# EAGLE design body-middle (EAGLE 9.6.2)
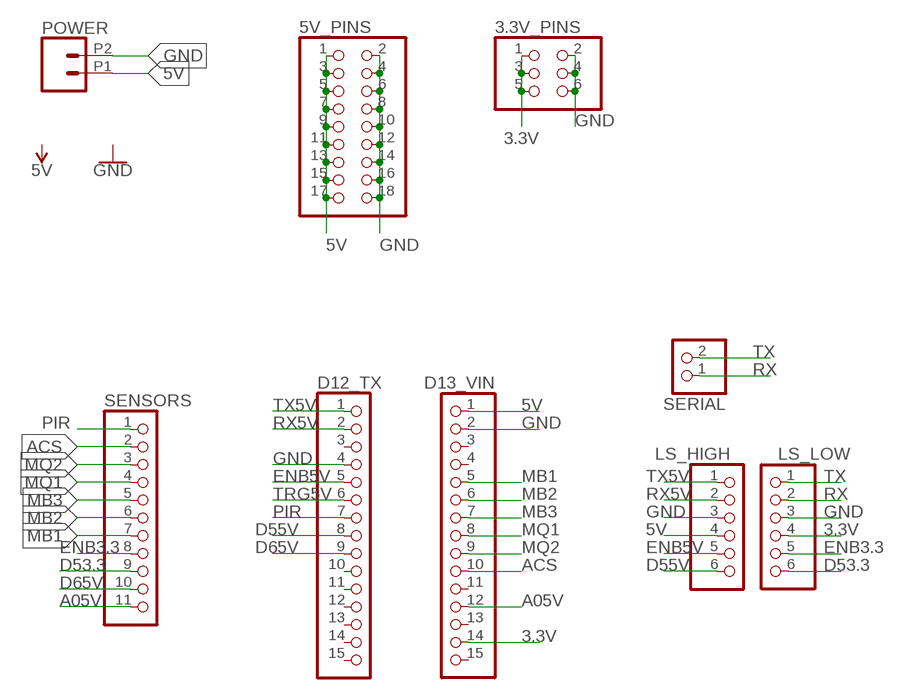
[diagram p0: schematic, sheet 1]

## Parts
3.3V_PINS  PINHD-2X3  [2X03]
5V_PINS  PINHD-2X9  [2X09]
D12_TX  PINHD-1X15  [1X15]
D13_VIN  PINHD-1X15  [1X15]
LS_HIGH  PINHD-1X6  [1X06]
LS_LOW  PINHD-1X6  [1X06]
POWER  CONN_022.54MM_SCREWTERM  [1X02_2.54_SCREWTERM]
SENSORS  PINHD-1X11  [1X11]
SERIAL  PINHD-1X2  [1X02]

## Nets
3.3V: 3.3V_PINS.1 3.3V_PINS.3 3.3V_PINS.5 D13_VIN.14 LS_LOW.4
5V: 5V_PINS.1 5V_PINS.3 5V_PINS.5 5V_PINS.7 5V_PINS.9 5V_PINS.11 5V_PINS.13 5V_PINS.15 5V_PINS.17 D13_VIN.1 LS_HIGH.4 POWER.P1
A05V: D13_VIN.12 SENSORS.11
ACS: D13_VIN.10 SENSORS.2
D53.3: LS_LOW.6 SENSORS.9
D55V: D12_TX.8 LS_HIGH.6
D65V: D12_TX.9 SENSORS.10
ENB3.3: LS_LOW.5 SENSORS.8
ENB5V: D12_TX.5 LS_HIGH.5
GND: 3.3V_PINS.2 3.3V_PINS.4 3.3V_PINS.6 5V_PINS.2 5V_PINS.4 5V_PINS.6 5V_PINS.8 5V_PINS.10 5V_PINS.12 5V_PINS.14 5V_PINS.16 5V_PINS.18 D12_TX.4 D13_VIN.2 LS_HIGH.3 LS_LOW.3 POWER.P2
MB1: D13_VIN.5 SENSORS.7
MB2: D13_VIN.6 SENSORS.6
MB3: D13_VIN.7 SENSORS.5
MQ1: D13_VIN.8 SENSORS.4
MQ2: D13_VIN.9 SENSORS.3
PIR: D12_TX.7 SENSORS.1
RX: LS_LOW.2 SERIAL.1
RX5V: D12_TX.2 LS_HIGH.2
TRG5V: D12_TX.6
TX: LS_LOW.1 SERIAL.2
TX5V: D12_TX.1 LS_HIGH.1
Unconnected: D12_TX.3 D12_TX.10 D12_TX.11 D12_TX.12 D12_TX.13 D12_TX.14 D12_TX.15 D13_VIN.3 D13_VIN.4 D13_VIN.11 D13_VIN.13 D13_VIN.15

## Library data of the parts
3.3V_PINS = pinhead:PINHD-2X3: PIN HEADER
5V_PINS = pinhead:PINHD-2X9: PIN HEADER
D12_TX D13_VIN = pinhead:PINHD-1X15: PIN HEADER
LS_HIGH LS_LOW = pinhead:PINHD-1X6: PIN HEADER
POWER = SparkFun-Connectors:CONN_02: Multi connection point. Often used as Generic Header-pin footprint for 0.1 inch spaced/style header connections On any of the 0.1 inch spaced packages, you can populate with these: Break Away Headers - Straight <https://www.sparkfun.com/products/116> (PRT-00116) Break Away Male Headers - Right Angle <https://www.sparkfun.com/products/553> (PRT-00553) Female Headers <https://www.sparkfun.com/products/115> (PRT-00115) Break Away Headers - Machine Pin <https://www.sparkfun.com/products/117> (PRT-00117) Break Away Female Headers - Swiss Machine Pin <https://www.sparkfun.com/products/743> (PRT-00743) For SCREWTERMINALS and SPRING TERMINALS visit here: Screw Terimnals on SparkFun.com <https://www.sparkfun.com/search/results?term=Screw+Terminals> (5mm/3.5mm/2.54mm spacing) This device is also useful as a general connection point to wire up your design to another part of your project. Our various solder wires solder well into these plated through hole pads. Hook-Up Wire - Assortment (Stranded, 22 AWG) <https://www.sparkfun.com/products/11375> (PRT-11375) Hook-Up Wire - Assortment (Solid Core, 22 AWG) <https://www.sparkfun.com/products/11367> (PRT-11367) View the entire wire category on our website here <https://www.sparkfun.com/categories/141> Special notes: Molex polarized connector foot print use with: PRT-08233 with associated crimp pins and housings. 2.54_SCREWTERM for use with PRT-10571. 3.5mm Screw Terminal footprints for PRT-08084 5mm Screw Terminal footprints for use with PRT-08432
SENSORS = pinhead:PINHD-1X11: PIN HEADER
SERIAL = pinhead:PINHD-1X2: PIN HEADER

## Board
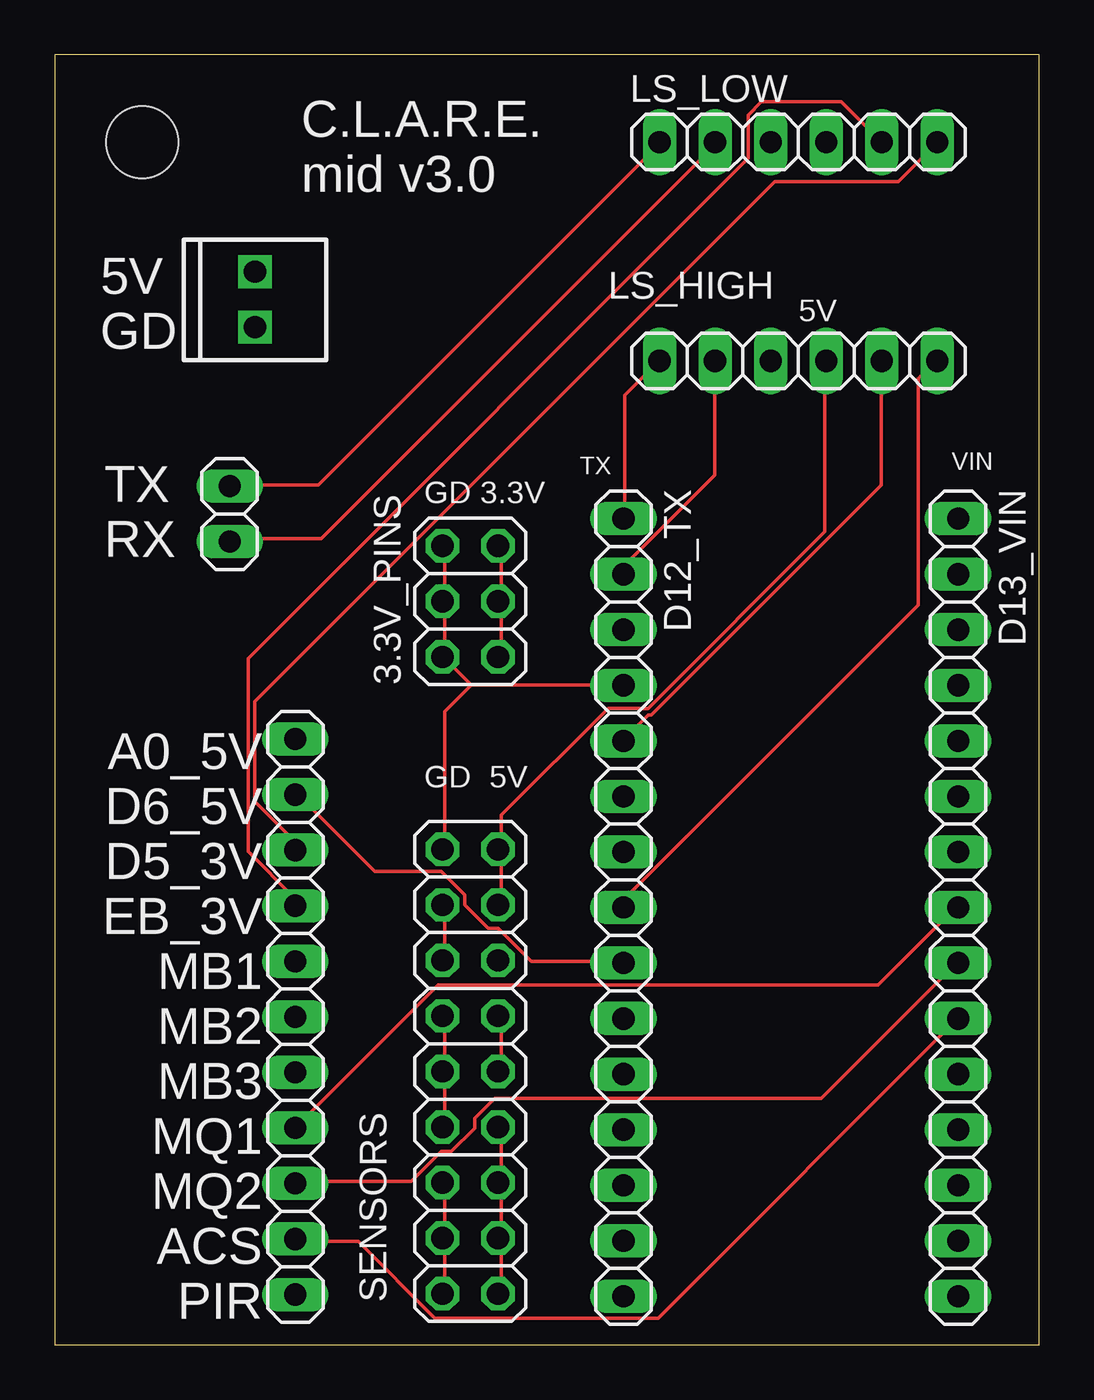
[diagram p1: board, top side]
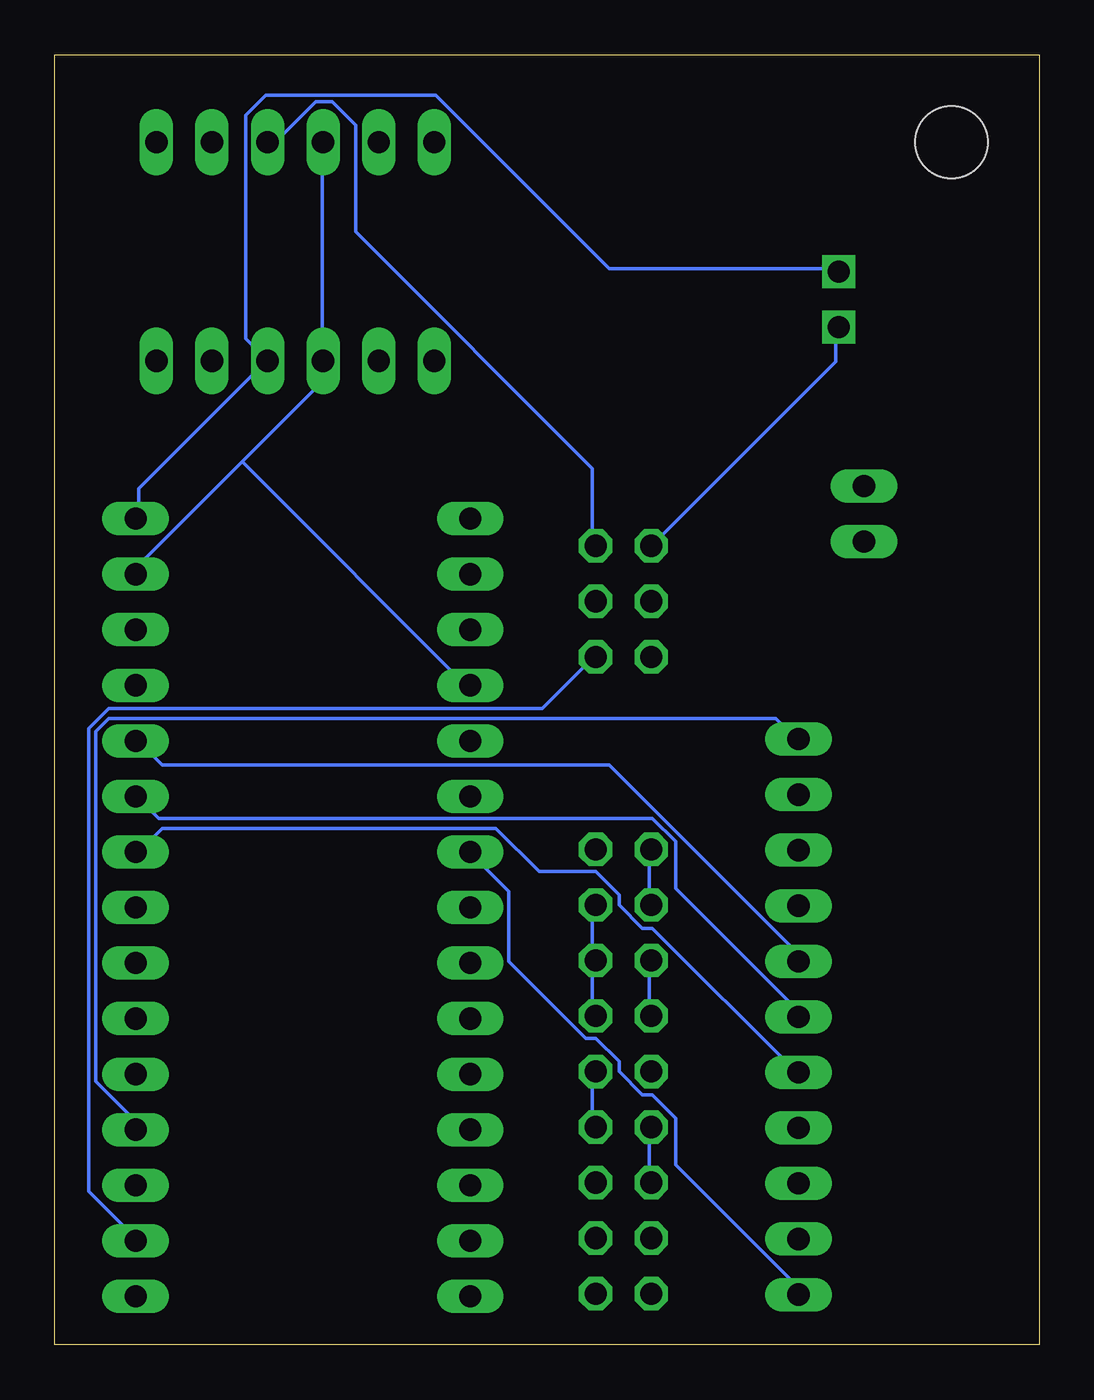
[diagram p2: board, bottom side, seen from below]

Size 45 x 59 mm. Coordinates in mm from the lower left corner, seen from the top.
Outline: 0,0 45,0 45,59 0,59 0,0
Copper layers (1*16): Top 0.035mm / dielectric 1.5mm / Bottom 0.035mm
Design rules "default": minimum track width 6mil, minimum drill 0.35mm, track to track 6mil, track to pad 6mil, pad to pad 6mil, via to via 6mil, smd to smd 6mil, copper to edge 40mil, drill to drill 6mil, minimum pad ring 10mil, minimum via ring 8mil, stop-mask expansion 4mil, vias tented up to drill 0mil, thermal gap 10mil
Holes 3.3 mm at 4,55

### Footprints (pad centres in the part's own frame; a part is rotated, then mirrored left to right if it is on the bottom)
2X03 = drill 1.016 octagon: 1 -2.54,-1.27; 2 -2.54,1.27; 3 0,-1.27; 4 0,1.27; 5 2.54,-1.27; 6 2.54,1.27
2X09 = drill 1.016 octagon: 1 -10.16,-1.27; 2 -10.16,1.27; 3 -7.62,-1.27; 4 -7.62,1.27; 5 -5.08,-1.27; 6 -5.08,1.27; 7 -2.54,-1.27; 8 -2.54,1.27; 9 0,-1.27; 10 0,1.27; 11 2.54,-1.27; 12 2.54,1.27; 13 5.08,-1.27; 14 5.08,1.27; 15 7.62,-1.27; 16 7.62,1.27; 17 10.16,-1.27; 18 10.16,1.27
1X15 = drill 1.016 long: 1 -17.78,0; 2 -15.24,0; 3 -12.7,0; 4 -10.16,0; 5 -7.62,0; 6 -5.08,0; 7 -2.54,0; 8 0,0; 9 2.54,0; 10 5.08,0; 11 7.62,0; 12 10.16,0; 13 12.7,0; 14 15.24,0; 15 17.78,0
1X06 = drill 1.016 long: 1 -6.35,0; 2 -3.81,0; 3 -1.27,0; 4 1.27,0; 5 3.81,0; 6 6.35,0
1X02_2.54_SCREWTERM = drill 1.016 square: P1 2.54,0; P2 0,0
1X11 = drill 1.016 long: 1 -12.7,0; 2 -10.16,0; 3 -7.62,0; 4 -5.08,0; 5 -2.54,0; 6 0,0; 7 2.54,0; 8 5.08,0; 9 7.62,0; 10 10.16,0; 11 12.7,0
1X02 = drill 1.016 long: 1 -1.27,0; 2 1.27,0

### Placement (x,y rotation side)
3.3V_PINS  19,34 90 top
5V_PINS  19,12.5 90 top
D12_TX  26,20 270 top
D13_VIN  41.3,20 270 top
LS_HIGH  34,45 0 top
LS_LOW  34,55 0 top
POWER  9.16,46.54 90 top
SENSORS  11,15 90 top
SERIAL  8,38 90 top

### Tracks (layer width: path | path; a pad name or v marks a point on that pad's centre or on a via)
3.3V
  Top 0.152: 3.3V_PINS.1 20.42,31.55 20.42,33.98 3.3V_PINS.3 20.42,34.14 20.42,36.42 3.3V_PINS.5
  Bottom 0.152: LS_LOW.4 35.2,55.02 34.9,55.02 33.07,56.84 32.31,56.84 31.24,55.78 31.24,50.9 20.42,40.08 20.42,36.58 3.3V_PINS.5 | D13_VIN.14 41.3,4.88 43.43,7.01 43.43,28.19 42.52,29.11 22.71,29.11 20.42,31.39 3.3V_PINS.1
5V
  Top 0.152: 5V_PINS.1 20.42,2.44 20.42,4.88 5V_PINS.3 20.42,5.03 20.42,7.32 5V_PINS.5 20.42,7.47 20.42,9.91 5V_PINS.7 | 5V_PINS.15 20.42,20.27 20.42,22.55 5V_PINS.17 20.42,22.71 20.42,24.23 25.3,29.11 27.13,29.11 35.2,37.19 35.2,44.96 LS_HIGH.4 | 5V_PINS.9 20.42,12.65 20.42,14.94 5V_PINS.11
  Bottom 0.152: 5V_PINS.11 20.42,15.09 20.42,17.53 5V_PINS.13 20.42,17.68 20.42,20.12 5V_PINS.15 | 5V_PINS.7 20.42,10.06 20.42,12.5 5V_PINS.9 | POWER.P1 9.3,49.23 19.66,49.23 27.58,57.15 35.36,57.15 36.27,56.24 36.27,46.02 35.36,45.11 LS_HIGH.4 35.36,44.96 41.15,39.17 41.15,37.8 D13_VIN.1
A05V
  Bottom 0.152: D13_VIN.12 41.3,9.91 41.3,10.21 43.13,12.04 43.13,28.04 42.52,28.65 12.04,28.65 11.12,27.74 SENSORS.11
ACS
  Top 0.152: SENSORS.2 11.12,4.72 13.87,4.72 17.37,1.22 27.58,1.22 41.15,14.78 D13_VIN.10
D53.3
  Top 0.152: SENSORS.9 10.97,22.71 10.97,23.01 9.14,24.84 9.14,29.41 32.92,53.19 38.56,53.19 40.23,54.86 LS_LOW.6
D55V
  Top 0.152: D12_TX.8 26.06,20.12 26.06,20.42 39.47,33.83 39.47,44.2 40.23,44.96 LS_HIGH.6
D65V
  Top 0.152: D12_TX.9 25.91,17.53 21.79,17.53 20.27,19.05 19.81,19.05 18.75,20.12 18.75,20.57 17.68,21.64 14.63,21.64 11.12,25.15 SENSORS.10
ENB3.3
  Top 0.152: SENSORS.8 10.97,20.12 10.97,20.42 8.84,22.55 8.84,31.39 31.7,54.25 31.7,56.24 32.31,56.84 35.97,56.84 37.8,55.02 LS_LOW.5
ENB5V
  Top 0.152: D12_TX.5 26.06,27.74 27.13,28.8 27.28,28.8 37.8,39.32 37.8,44.96 LS_HIGH.5
GND
  Top 0.152: 5V_PINS.2 17.83,2.44 17.83,4.88 5V_PINS.4 17.83,5.03 17.83,7.32 5V_PINS.6 | 5V_PINS.12 17.83,14.94 17.83,12.65 5V_PINS.10 17.83,12.5 17.83,10.06 5V_PINS.8 | 5V_PINS.16 17.83,20.12 17.83,17.68 5V_PINS.14 | 3.3V_PINS.6 17.83,36.42 17.83,34.14 3.3V_PINS.4 17.83,33.98 17.83,31.55 3.3V_PINS.2 17.83,31.39 19.05,30.18 | 19.05,30.18 25.91,30.18 D12_TX.4 | 19.05,30.18 17.83,28.96 17.83,22.71 5V_PINS.18
  Bottom 0.152: LS_LOW.3 32.77,54.86 32.77,45.11 LS_HIGH.3 32.77,44.96 32.77,44.04 36.42,40.39 | 36.42,40.39 41.15,35.66 41.15,35.36 D13_VIN.2 | 5V_PINS.8 17.83,9.91 17.83,7.47 5V_PINS.6 | 5V_PINS.16 17.83,20.27 17.83,22.55 5V_PINS.18 | 5V_PINS.14 17.83,17.53 17.83,15.09 5V_PINS.12 | POWER.P2 9.3,46.48 9.3,44.96 17.68,36.58 3.3V_PINS.6 | 36.42,40.39 26.06,30.02 D12_TX.4
MB1
  Bottom 0.152: SENSORS.7 11.12,17.68 11.12,17.98 19.66,26.52 40.08,26.52 41.15,27.58 D13_VIN.5
MB2
  Bottom 0.152: SENSORS.6 11.12,15.09 11.12,15.39 16.61,20.88 16.61,23.01 17.68,24.08 40.23,24.08 41.15,24.99 D13_VIN.6
MB3
  Bottom 0.152: SENSORS.5 11.12,12.5 17.68,19.05 18.14,19.05 19.2,20.12 19.2,20.57 20.27,21.64 22.86,21.64 24.84,23.62 40.08,23.62 41.15,22.55 D13_VIN.7
MQ1
  Top 0.152: SENSORS.4 11.12,10.06 17.53,16.46 37.64,16.46 41.15,19.96 D13_VIN.8
MQ2
  Top 0.152: SENSORS.3 11.12,7.47 16.31,7.47 17.68,8.84 18.14,8.84 19.2,9.91 19.2,10.36 20.12,11.28 35.05,11.28 41.15,17.37 D13_VIN.9
PIR
  Bottom 0.152: SENSORS.1 11.12,2.44 11.12,2.74 16.61,8.23 16.61,10.36 17.68,11.43 18.14,11.43 19.2,12.5 19.2,12.95 20.27,14.02 20.73,14.02 24.23,17.53 24.23,20.73 25.91,22.4 D12_TX.7
RX
  Top 0.152: SERIAL.1 8.12,36.88 12.19,36.88 30.18,54.86 LS_LOW.2
RX5V
  Top 0.152: D12_TX.2 26.06,35.36 26.06,35.66 30.18,39.78 30.18,44.96 LS_HIGH.2
TX
  Top 0.152: SERIAL.2 8.12,39.32 12.04,39.32 27.58,54.86 LS_LOW.1
TX5V
  Top 0.152: D12_TX.1 26.06,37.8 26.06,43.43 27.58,44.96 LS_HIGH.1

### Text on the board
tNames: C.L.A.R.E. / mid v3.0 | 5V | 5V / GD | TX | VIN | GD 3.3V | TX / RX | A0_5V / D6_5V / D5_3V / EB_3V / MB1 / MB2 / MB3 / MQ1 / MQ2 / ACS / PIR | GD 5V